# Altium schematic sheet 深圳重合闸控制板.SchDoc
size A1; SheetNumber: 0; SheetTotal: 0; PageSetup: Record=PageOptions|CenterHorizontal=True|CenterVertical=True|PrintScale=0.46|XCorrection=1.00|YCorrection=1.00|PrintKind=0|BorderSize=5000000|LeftOffset=0|BottomOffset=0|Orientation=2|PaperLength=1000|PaperWidth=1000|Scale=100|PaperSource=7|PrintQuality=-3|MediaType=1|DitherType=10|PrintScaleMode=1|PaperKind=A4|PaperIndex=9
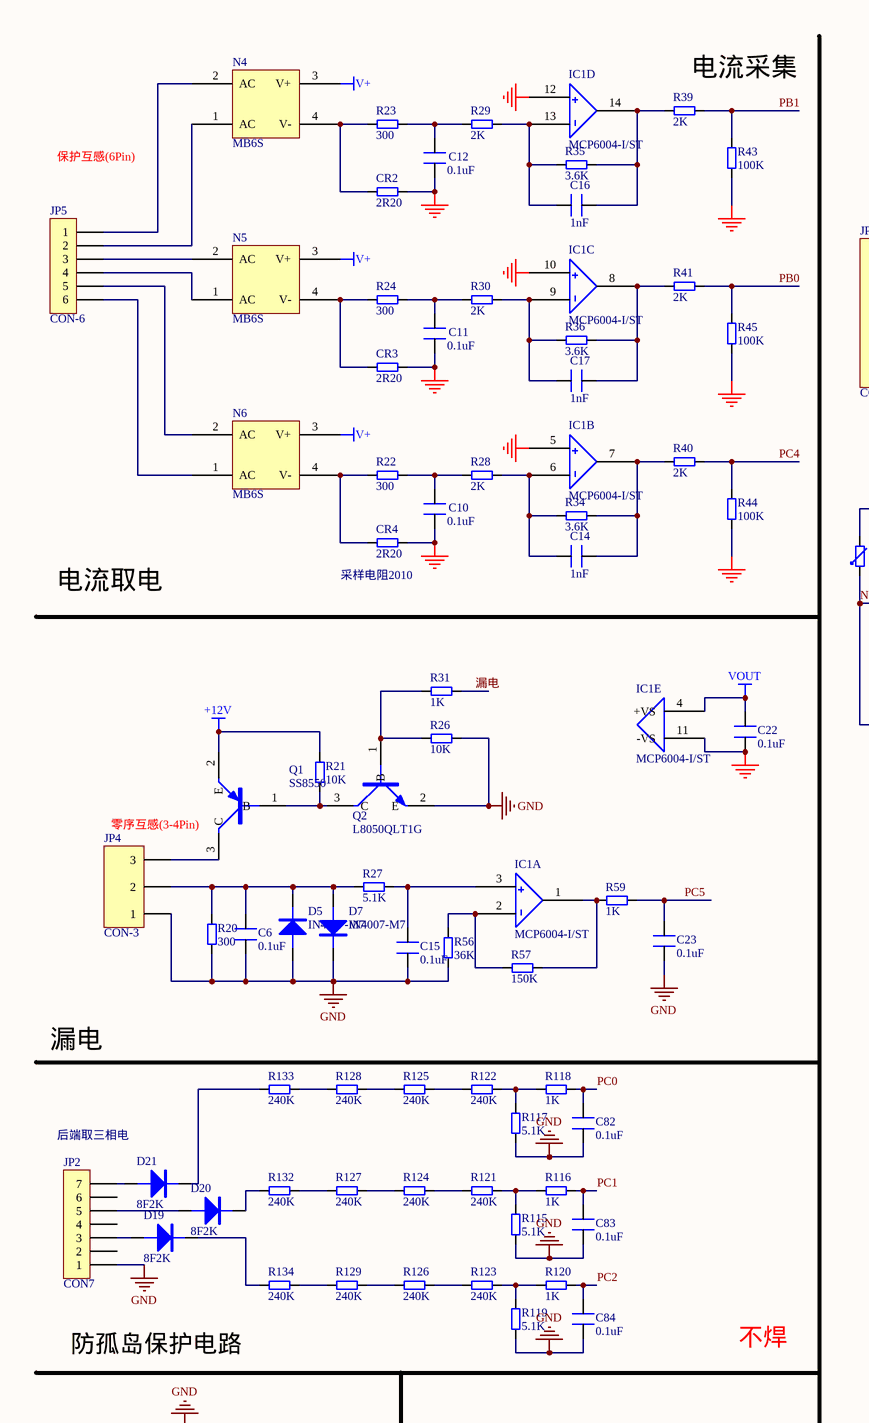
[diagram p0: 深圳重合闸控制板.SchDoc, top left]
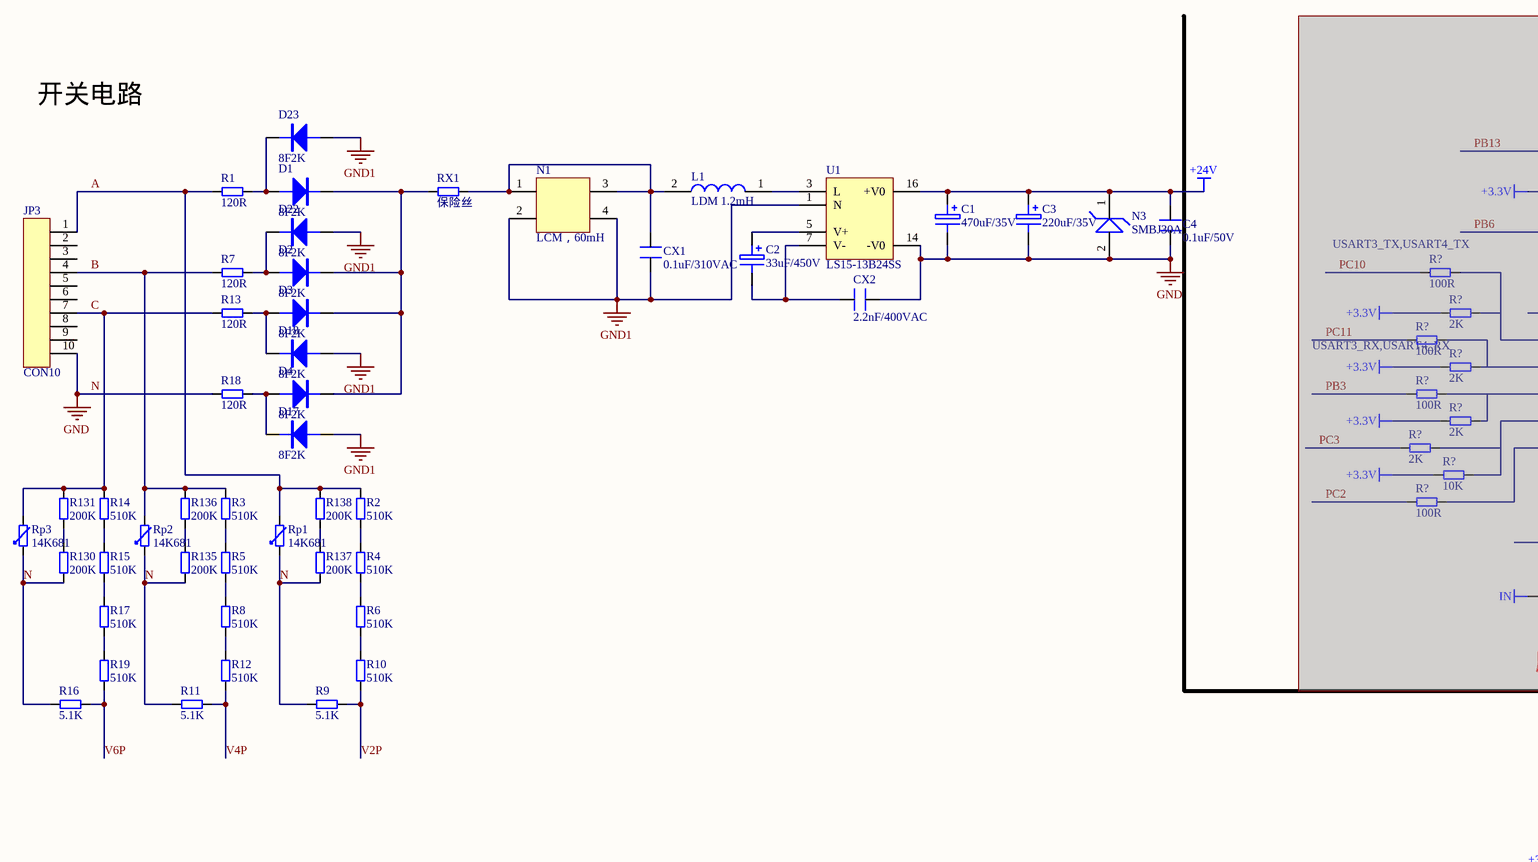
[diagram p1: 深圳重合闸控制板.SchDoc, top middle]
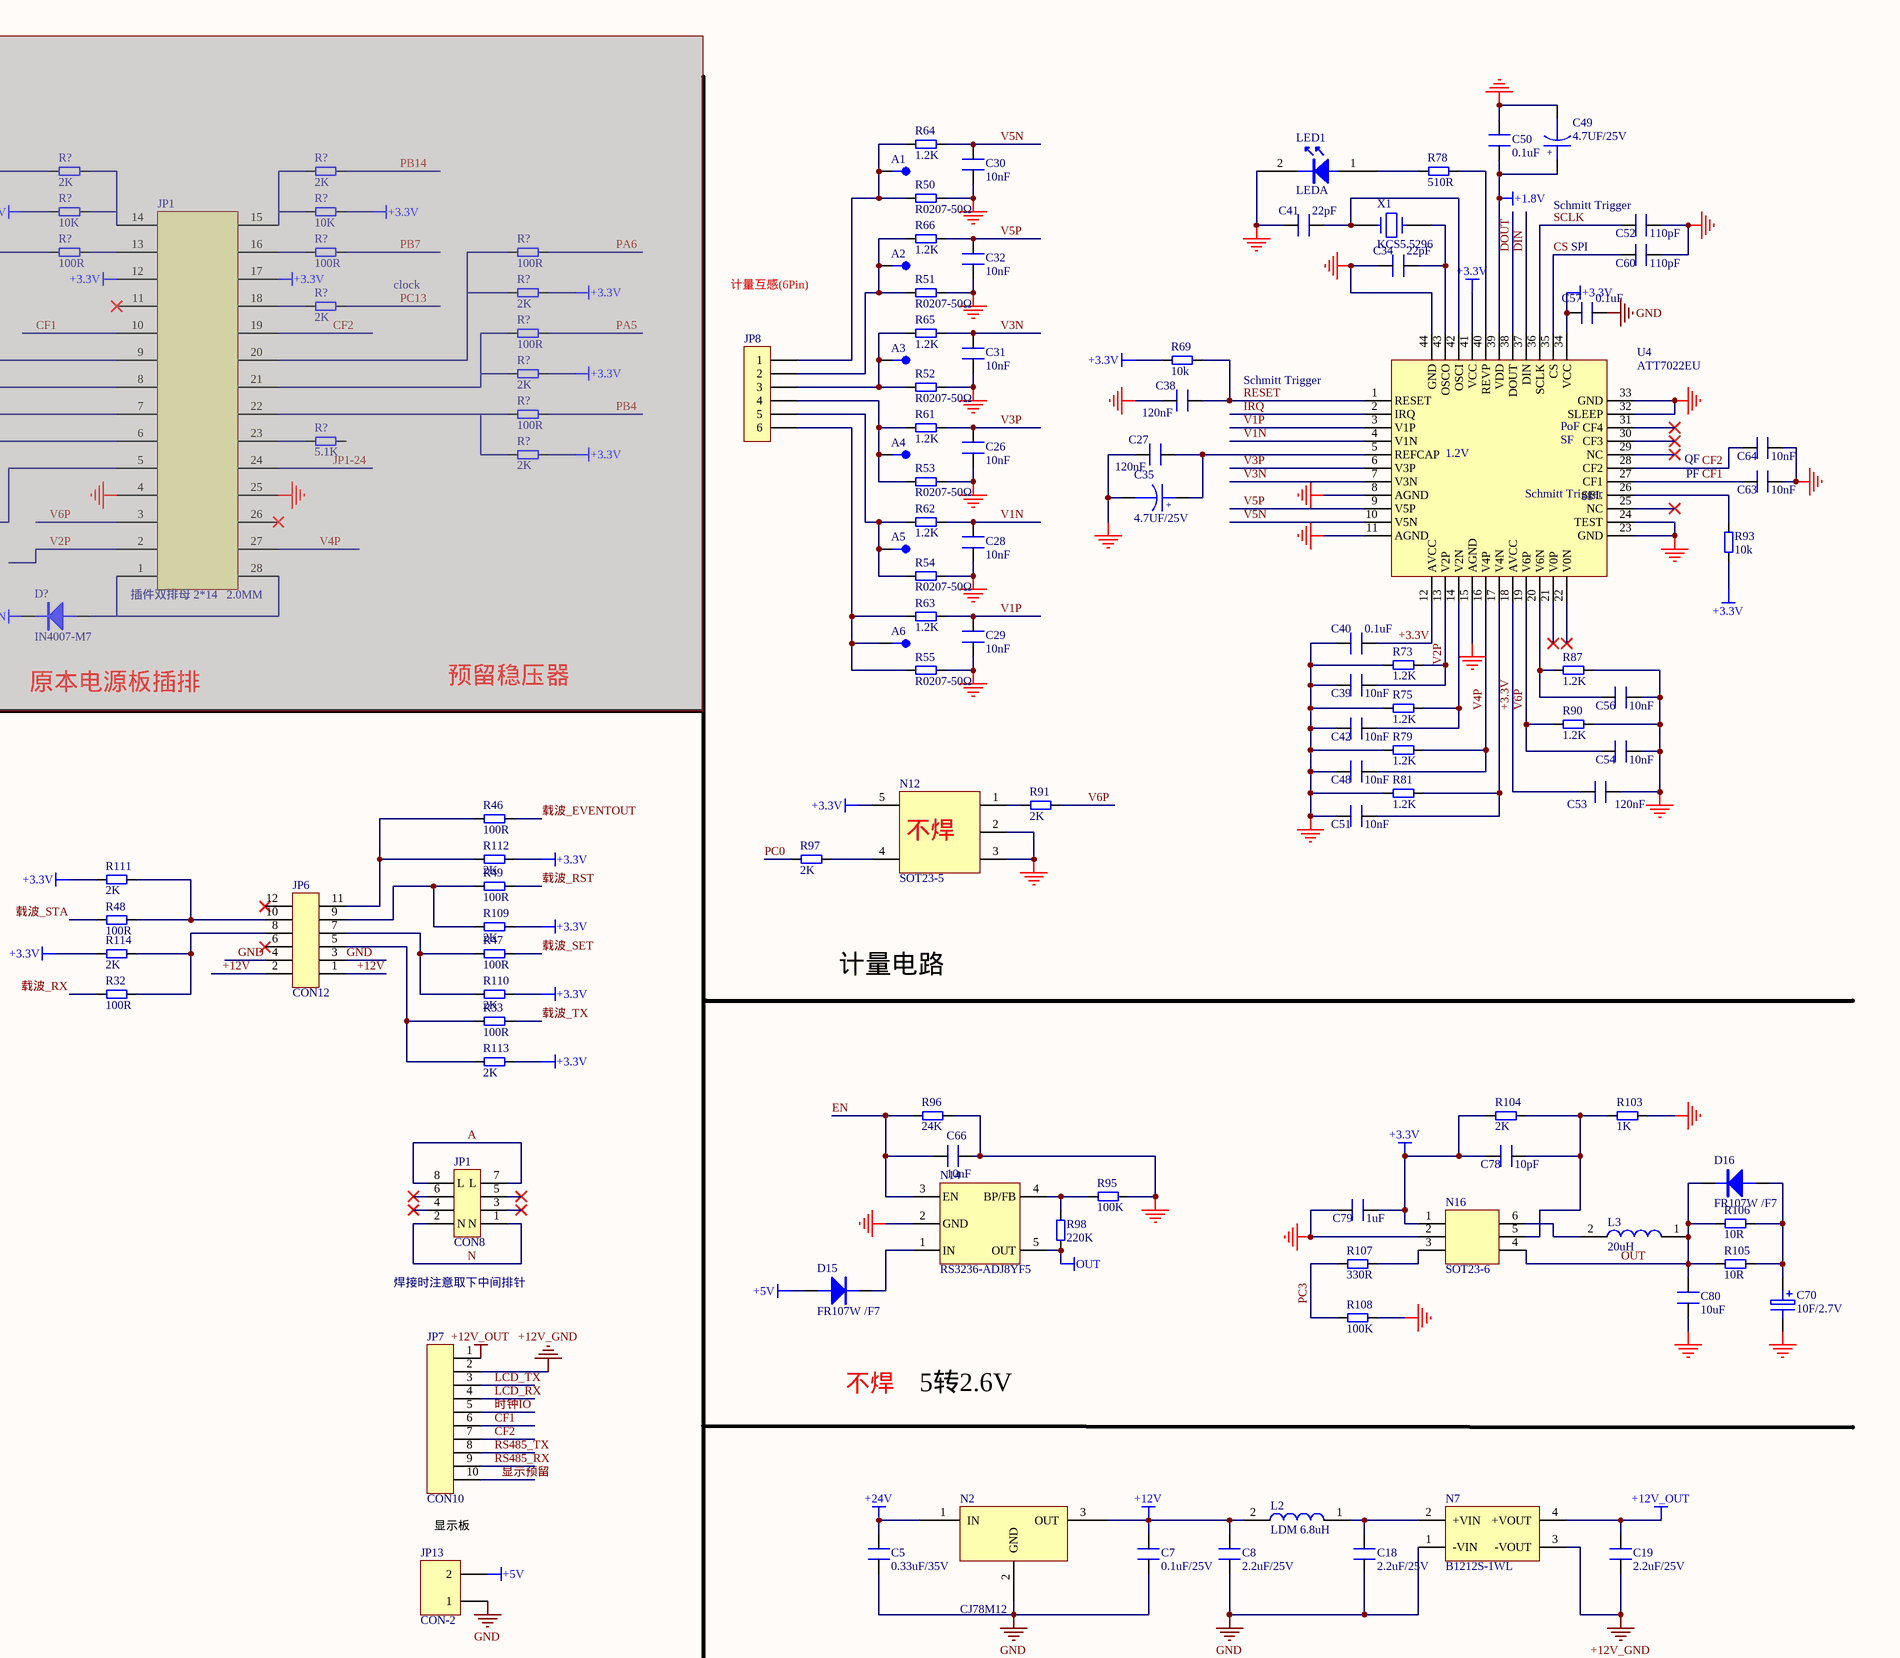
[diagram p2: 深圳重合闸控制板.SchDoc, top right]
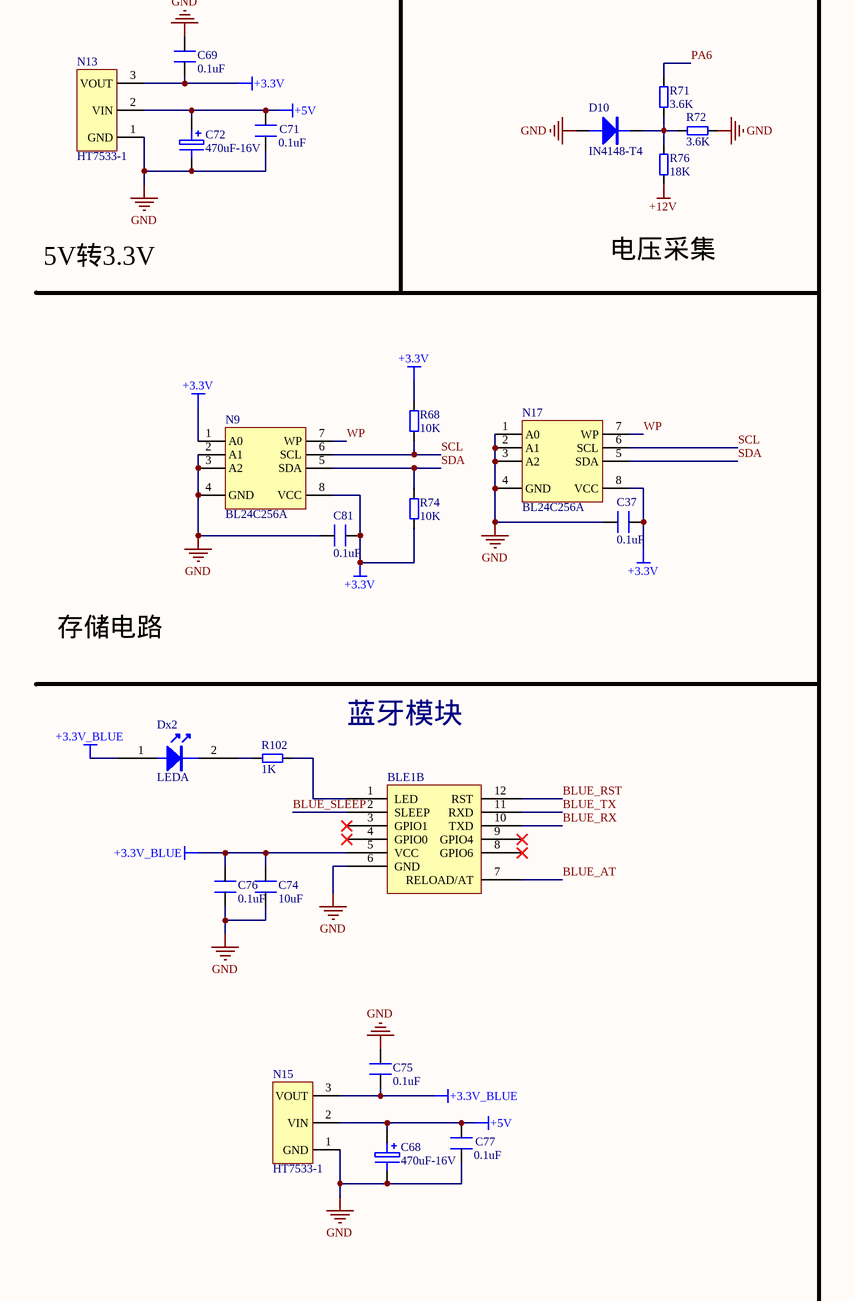
[diagram p3: 深圳重合闸控制板.SchDoc, bottom left]
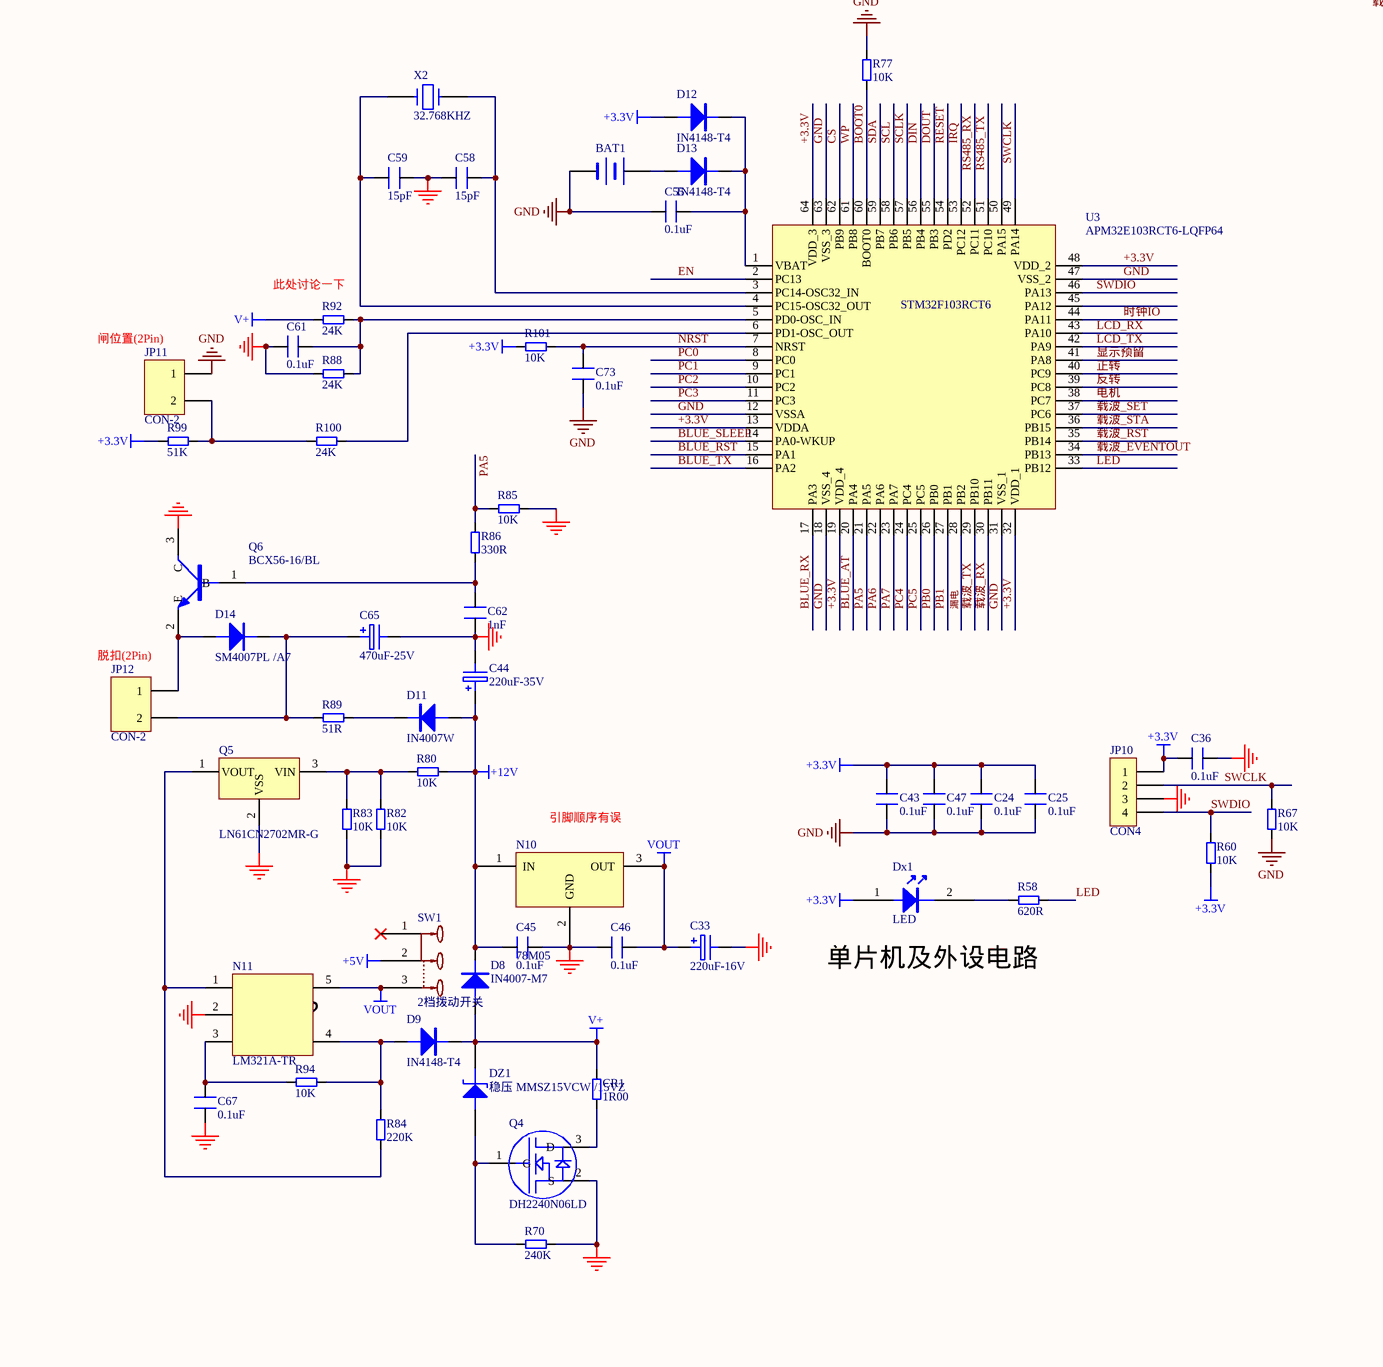
[diagram p4: 深圳重合闸控制板.SchDoc, bottom middle]
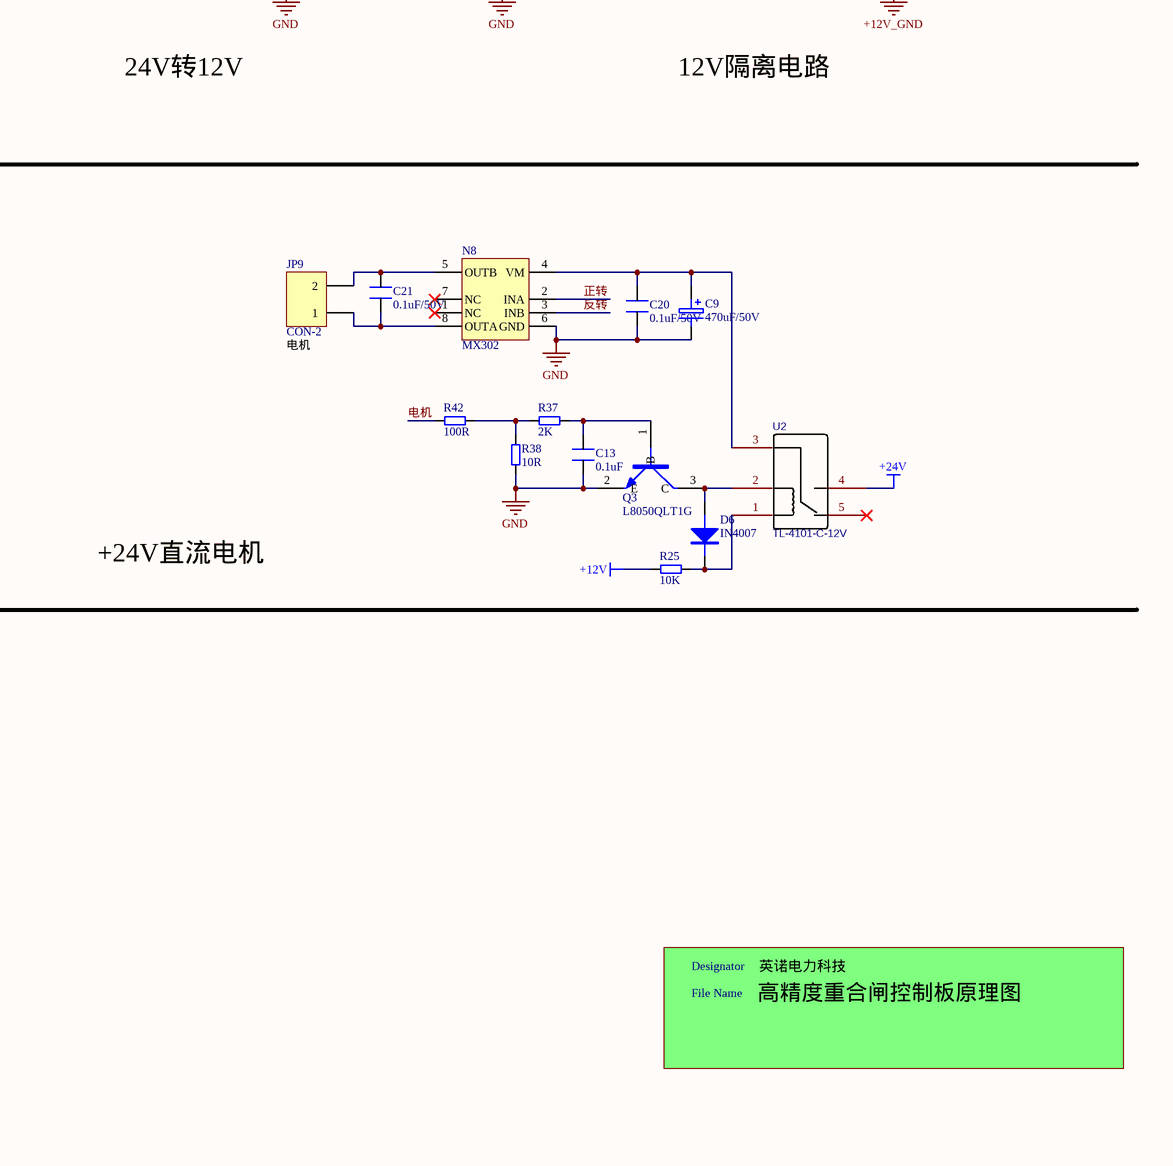
[diagram p5: 深圳重合闸控制板.SchDoc, bottom right]

## Parts
(Parts that share a designator on the sheet are numbered #1, #2 ... from top to bottom, then left to right.)
A1  TP  [TP]  (value not drawn)
A2  TP  [TP]  (value not drawn)
A3  TP  [TP]  (value not drawn)
A4  TP  [TP]  (value not drawn)
A5  TP  [TP]  (value not drawn)
A6  TP  [TP]  (value not drawn)
BAT1  (no value)  [BATTERY]
BLE1  BLE-TPT-BLUETEETH  [蓝牙]  (value not drawn)  (part B of 2)
C1  470uF/35V  [CAP_5.0SP]
C2  33uF/450V  [EWH2WM330K20OT]
C3  220uF/35V  [CAP]
C4  0.1uF/50V  [C0603]
C5  0.33uF/35V  [C0603]
C6  0.1uF  [C0603]
C7  0.1uF/25V  [C0603]
C8  2.2uF/25V  [C0603]
C9  470uF/50V  [RVT1H471M1213]
C10  0.1uF  [C0603]
C11  0.1uF  [C0603]
C12  0.1uF  [C0603]
C13  0.1uF  [C0603]
C14  1nF  [C0603]
C15  0.1uF  [C0603]
C16  1nF  [C0603]
C17  1nF  [C0603]
C18  2.2uF/25V  [C0603]
C19  2.2uF/25V  [C0603]
C20  0.1uF/50V  [C0603]
C21  0.1uF/50V  [C0603]
C22  0.1uF  [C0603]
C23  0.1uF  [C0603]
C24  0.1uF  [C0603]
C25  0.1uF  [C0603]
C26  10nF  [C0603]
C27  120nF  [C0603]
C28  10nF  [C0603]
C29  10nF  [C0603]
C30  10nF  [C0603]
C31  10nF  [C0603]
C32  10nF  [C0603]
C33  220uF-16V  [CAP]
C34  22pF  [C0603]
C35  4.7UF/25V  [CAK]
C36  0.1uF  [C0603]
C37  0.1uF  [c0603]
C38  120nF  [C0603]
C39  10nF  [C0603]
C40  0.1uF  [C0603]
C41  22pF  [C0603]
C42  10nF  [C0603]
C43  0.1uF  [C0603]
C44  220uF-35V  [CAP]
C45  0.1uF  [C0603]
C46  0.1uF  [C0603]
C47  0.1uF  [C0603]
C48  10nF  [C0603]
C49  4.7UF/25V  [CAK]
C50  0.1uF  [C0603]
C51  10nF  [C0603]
C52  110pF  [C0603]
C53  120nF  [C0603]
C54  10nF  [C0603]
C55  0.1uF  [C0603]
C56  10nF  [C0603]
C57  0.1uF  [C0603]
C58  15pF  [C0603]
C59  15pF  [C0603]
C60  110pF  [C0603]
C61  0.1uF  [C0603]
C62  1nF  [C0603]
C63  10nF  [C0603]
C64  10nF  [C0603]
C65  470uF-25V  [CAP]
C66  10nF  [C0603]
C67  0.1uF  [C0603]
C68  470uF-16V  [CAP]
C69  0.1uF  [C0603]
C70  10F/2.7V  [EWH2WM330K20OT]
C71  0.1uF  [C0603]
C72  470uF-16V  [CAP]
C73  0.1uF  [C0603]
C74  10uF  [C0603]
C75  0.1uF  [C0603]
C76  0.1uF  [C0603]
C77  0.1uF  [C0603]
C78  10pF  [C0603]
C79  1uF  [C0603]
C80  10uF  [C0603]
C81  0.1uF  [c0603]
C82  0.1uF  [C0603]
C83  0.1uF  [C0603]
C84  0.1uF  [C0603]
CR1  1R00  [R2010]
CR2  2R20  [R2010]
CR3  2R20  [R2010]
CR4  2R20  [R2010]
CX1  0.1uF/310VAC  [X2-0310A104K10WLBY]
CX2  2.2nF/400VAC  [CT81-400VAC-222M]
D1  8F2K  [IN4007-M7]
D2  8F2K  [IN4007-M7]
D3  8F2K  [IN4007-M7]
D4  8F2K  [IN4007-M7]
D5  IN4007-M7  [IN4007-M7]
D6  IN4007  [IN4007-M7]
D7  IN4007-M7  [IN4007-M7]
D8  IN4007-M7  [IN4007-M7]
D9  IN4148-T4  [IN4148-T4]
D10  IN4148-T4  [IN4148-T4]
D11  IN4007W  [IN4148-T4]
D12  IN4148-T4  [IN4148-T4]
D13  IN4148-T4  [IN4148-T4]
D14  SM4007PL /A7  [IN4148-T4]
D15  FR107W /F7  [IN4148-T4]
D16  FR107W /F7  [IN4148-T4]
D17  8F2K  [IN4007-M7]
D18  8F2K  [IN4007-M7]
D19  8F2K  [IN4007-M7]
D20  8F2K  [IN4007-M7]
D21  8F2K  [IN4007-M7]
D22  8F2K  [IN4007-M7]
D23  8F2K  [IN4007-M7]
D?  IN4007-M7  [IN4007-M7]  (masked out: inside a compile mask, not in the netlist)
Dx1  LED  [LEDB]
Dx2  LEDA  [LEDB]
DZ1  稳压 MMSZ15VCW /15VZ  [IN4148-T4]
IC1  MCP6004-I/ST  [SOP14_0.65SP]  (parts A,B,C,D,E of 5)
JP1#1  插件双排母 2*14   2.0MM  (masked out: inside a compile mask, not in the netlist)
JP1#2  CON8  [SIP2*4_2.54SP]
JP2  CON7  [HDR2.54-7P]
JP3  CON10  [HDR2.54-10P]
JP4  CON-3  [HDR2.54-3P]
JP5  CON-6  [HDR2.54-6P]
JP6  CON12  [SIP2*6_2.54SP]
JP7  CON10  [PH2.0-10P]
JP8  (no value)  [SIP1*6_1.5SP]
JP9  CON-2  [HDR2.54-2P]
JP10  CON4  [HDR2.54-4P]
JP11  CON-2  [HDR2.54-2P]
JP12  CON-2  [HDR2.54-2P]
JP13  CON-2  [PH2.0-2P]
L1  LDM 1.2mH  [PDMTAT044125-6R8MLU]
L2  LDM 6.8uH  [PDMTAT044125-6R8MLU]
L3  20uH  [L0805]
LED1  LEDA  [LEDA]
N1  LCM，60mH  [LCM]
N2  CJ78M12  [TO-252(DPAK)]
N3  SMBJ30A  [SMBJ30A]
N4  MB6S  [MB6S]
N5  MB6S  [MB6S]
N6  MB6S  [MB6S]
N7  B1212S-1WL  [B1212S-1WL]
N8  MX302  [SOP8_1.27SP_4*5SR]
N9  BL24C256A  [SOP8_1.27SP_4*5SR]
N10  78M05  [78M05]
N11  LM321A-TR  [SOT23-5]
N12  SOT23-5  [SOT23-5]
N13  HT7533-1  [HT7533-1]
N14  RS3236-ADJ8YF5  [SOT23-5]
N15  HT7533-1  [HT7533-1]
N16  SOT23-6  [SOT23-6]
N17  BL24C256A  [SOP8_1.27SP_4*5SR]
Q1  SS8550  [S8050 /J3Y]
Q2  L8050QLT1G  [S8050 /J3Y]
Q3  L8050QLT1G  [S8050 /J3Y]
Q4  DH2240N06LD  [78M05]
Q5  LN61CN2702MR-G  [SOT23-3]
Q6  BCX56-16/BL  [BCX56-16/BL]
R1  120R  [插针电阻]
R2  510K  [R0603]
R3  510K  [R0603]
R4  510K  [R0603]
R5  510K  [R0603]
R6  510K  [R0603]
R7  120R  [插针电阻]
R8  510K  [R0603]
R9  5.1K  [R0603]
R10  510K  [R0603]
R11  5.1K  [R0603]
R12  510K  [R0603]
R13  120R  [插针电阻]
R14  510K  [R0603]
R15  510K  [R0603]
R16  5.1K  [R0603]
R17  510K  [R0603]
R18  120R  [插针电阻]
R19  510K  [R0603]
R20  300  [R0603]
R21  10K  [R0603]
R22  300  [R0603]
R23  300  [R0603]
R24  300  [R0603]
R25  10K  [R0603]
R26  10K  [R0603]
R27  5.1K  [R0603]
R28  2K  [R0603]
R29  2K  [R0603]
R30  2K  [R0603]
R31  1K  [R0603]
R32  100R  [R0603]
R33  100R  [R0603]
R34  3.6K  [R0603]
R35  3.6K  [R0603]
R36  3.6K  [R0603]
R37  2K  [R0603]
R38  10R  [R0603]
R39  2K  [R0603]
R40  2K  [R0603]
R41  2K  [R0603]
R42  100R  [R0603]
R43  100K  [R0603]
R44  100K  [R0603]
R45  100K  [R0603]
R46  100R  [R0603]
R47  100R  [R0603]
R48  100R  [R0603]
R49  100R  [R0603]
R50  R0207-50Ω  [R0207]
R51  R0207-50Ω  [R0207]
R52  R0207-50Ω  [R0207]
R53  R0207-50Ω  [R0207]
R54  R0207-50Ω  [R0207]
R55  R0207-50Ω  [R0207]
R56  36K  [R0603]
R57  150K  [R0603]
R58  620R  [R0603]
R59  1K  [R0603]
R60  10K  [R0603]
R61  1.2K  [R0603]
R62  1.2K  [R0603]
R63  1.2K  [R0603]
R64  1.2K  [R0603]
R65  1.2K  [R0603]
R66  1.2K  [R0603]
R67  10K  [R0603]
R68  10K  [R0603]
R69  10k  [R0603]
R70  240K  [R0603]
R71  3.6K  [R0603]
R72  3.6K  [R0603]
R73  1.2K  [R0603]
R74  10K  [R0603]
R75  1.2K  [R0603]
R76  18K  [R0603]
R77  10K  [R0603]
R78  510R  [R0603]
R79  1.2K  [R0603]
R80  10K  [R0603]
R81  1.2K  [R0603]
R82  10K  [R0603]
R83  10K  [R0603]
R84  220K  [R0603]
R85  10K  [R0603]
R86  330R  [R0603]
R87  1.2K  [R0603]
R88  24K  [R0603]
R89  51R  [R1206]
R90  1.2K  [R0603]
R91  2K  [R0603]
R92  24K  [R0603]
R93  10k  [R0603]
R94  10K  [R0603]
R95  100K  [R0603]
R96  24K  [R0603]
R97  2K  [R0603]
R98  220K  [R0603]
R99  51K  [R0603]
R100  24K  [R0603]
R101  10K  [R0603]
R102  1K  [R0603]
R103  1K  [R0603]
R104  2K  [R0603]
R105  10R  [R1206]
R106  10R  [R1206]
R107  330R  [R0603]
R108  100K  [R0603]
R109  2K  [R0603]
R110  2K  [R0603]
R111  2K  [R0603]
R112  2K  [R0603]
R113  2K  [R0603]
R114  2K  [R0603]
R115  5.1K  [R0603]
R116  1K  [R0603]
R117  5.1K  [R0603]
R118  1K  [R0603]
R119  5.1K  [R0603]
R120  1K  [R0603]
R121  240K  [R0603]
R122  240K  [R0603]
R123  240K  [R0603]
R124  240K  [R0603]
R125  240K  [R0603]
R126  240K  [R0603]
R127  240K  [R0603]
R128  240K  [R0603]
R129  240K  [R0603]
R130  200K  [R0603]
R131  200K  [R0603]
R132  240K  [R0603]
R133  240K  [R0603]
R134  240K  [R0603]
R135  200K  [R0603]
R136  200K  [R0603]
R137  200K  [R0603]
R138  200K  [R0603]
R?#1  2K  [R0603]  (masked out: inside a compile mask, not in the netlist)
R?#2  2K  [R0603]  (masked out: inside a compile mask, not in the netlist)
R?#3  10K  [R0603]  (masked out: inside a compile mask, not in the netlist)
R?#4  10K  [R0603]  (masked out: inside a compile mask, not in the netlist)
R?#5  100R  [R0603]  (masked out: inside a compile mask, not in the netlist)
R?#6  100R  [R0603]  (masked out: inside a compile mask, not in the netlist)
R?#7  100R  [R0603]  (masked out: inside a compile mask, not in the netlist)
R?#8  100R  [R0603]  (masked out: inside a compile mask, not in the netlist)
R?#9  2K  [R0603]  (masked out: inside a compile mask, not in the netlist)
R?#10  2K  [R0603]  (masked out: inside a compile mask, not in the netlist)
R?#11  2K  [R0603]  (masked out: inside a compile mask, not in the netlist)
R?#12  100R  [R0603]  (masked out: inside a compile mask, not in the netlist)
R?#13  100R  [R0603]  (masked out: inside a compile mask, not in the netlist)
R?#14  2K  [R0603]  (masked out: inside a compile mask, not in the netlist)
R?#15  2K  [R0603]  (masked out: inside a compile mask, not in the netlist)
R?#16  100R  [R0603]  (masked out: inside a compile mask, not in the netlist)
R?#17  100R  [R0603]  (masked out: inside a compile mask, not in the netlist)
R?#18  2K  [R0603]  (masked out: inside a compile mask, not in the netlist)
R?#19  5.1K  [R0603]  (masked out: inside a compile mask, not in the netlist)
R?#20  2K  [R0603]  (masked out: inside a compile mask, not in the netlist)
R?#21  2K  [R0603]  (masked out: inside a compile mask, not in the netlist)
R?#22  10K  [R0603]  (masked out: inside a compile mask, not in the netlist)
R?#23  100R  [R0603]  (masked out: inside a compile mask, not in the netlist)
Rp1  14K681  [14K681]
Rp2  14K681  [14K681]
Rp3  14K681  [14K681]
RX1  保险丝  [插针电阻]
SW1  2档拨动开关  [SW-3]
U1  LS15-13B24SS  [LS15-13B24SS-F]
U2  TL-4101-C-12V  [TL4101]
U3  APM32E103RCT6-LQFP64  [LQFP-64]
U4  ATT7022EU  [LQFP44_0.8SP_10*10SR]
X1  KCS5.5296  [CRYSTAL2]
X2  32.768KHZ  [CRYSTAL1]

## Sub-sheets
Designator = File Name: no entries

## Nets
+1.8V: C49.1 C50.2 U4.39(VDD)
+3.3V: C24.1 C25.1 C36.1 C37.1 C40.1 C43.1 C47.1 C53.2 C57.2 C69.2 C78.2 C79.1 C81.1 D12.1(A) Dx1.1 JP10.1 N9.1(A0) N9.8(VCC) N12.5 N13.3(VOUT) N16.1 N17.8(VCC) R60.1 R68.2 R69.2 R74.1 R93.2 R99.1 R101.2 R104.1 R109.2 R110.2 R111.2 R112.2 R113.2 R114.2 U3.13(VDDA) U3.19(VDD_4) U3.32(VDD_1) U3.48(VDD_2) U3.64(VDD_3) U4.12(AVCC) U4.18(AVCC) U4.34(VCC) U4.41(VCC)
+3.3V_BLUE: BLE1.5(VCC) C74.2 C75.2 C76.2 Dx2.1 N15.3(VOUT)
+5V: C68.1 C71.2 C72.1 C77.2 D15.1(A) JP13.2 N13.2(VIN) N15.2(VIN) SW1.2
+12V: C7.2 C8.2 C44.1 C45.2 D8.2(K) D11.1(A) JP6.1 JP6.2 L2.2 N2.3(OUT) N10.1(IN) Q1.2(E) R21.2 R25.1 R76.2 R80.1
+12V_GND: C19.1 JP7.2 N7.3(-VOUT)
+12V_OUT: C19.2 JP7.1 N7.4(+VOUT)
+24V: C1.1 C3.1 C4.2 C5.2 N2.1(IN) N3.1 U1.16(+V0) U2.4
GND: BAT1.2(-) BLE1.6(GND) C1.2 C3.2 C4.1 C5.1 C6.1 C7.1 C8.1 C9.2 C10.1 C11.1 C12.1 C13.1 C15.1 C18.1 C20.1 C22.1 C23.2 C24.2 C25.2 C26.1 C27.2 C28.1 C29.1 C30.1 C31.1 C32.1 C33.2 C34.2 C35.2 C36.2 C37.2 C38.2 C39.2 C40.2 C41.2 C42.2 C43.2 C44.2 C45.1 C46.2 C47.2 C48.2 C49.2 C50.1 C51.2 C52.1 C53.1 C54.1 C55.2 C56.1 C57.1 C58.2 C59.1 C60.1 C61.2 C62.2 C63.1 C64.1 C65.2 C66.2 C67.2 C68.2 C69.1 C70.2 C71.1 C72.2 C73.2 C74.1 C75.1 C76.1 C77.1 C79.2 C80.2 C81.2 C82.2 C83.2 C84.2 CR2.1 CR3.1 CR4.1 CX2.1 D5.1(A) D7.2(K) D10.1(A) IC1.5 IC1.10 IC1.11(-VS) IC1.12 JP1#2.1(N) JP1#2.2(N) JP2.1 JP3.10 JP4.1 JP6.3 JP6.4 JP10.3 JP11.1 JP13.1 LED1.2 N2.2(GND) N3.2 N7.1(-VIN) N8.6(GND) N9.2(A1) N9.3(A2) N9.4(GND) N10.2(GND) N11.2 N12.2 N12.3 N13.1(GND) N14.2(GND) N15.1(GND) N16.2 N17.1(A0) N17.2(A1) N17.3(A2) N17.4(GND) Q2.2(E) Q3.2(E) Q4.2(S) Q5.2(VSS) Q6.3(C) R9.1 R11.1 R16.1 R18.2 R20.1 R26.1 R38.2 R43.2 R44.2 R45.2 R50.2 R51.2 R52.2 R53.2 R54.2 R55.2 R56.2 R67.1 R70.2 R72.1 R73.2 R75.2 R77.1 R79.2 R81.2 R82.1 R83.1 R85.2 R87.1 R88.1 R90.1 R95.2 R96.2 R103.2 R108.2 R115.2 R117.2 R119.2 R130.2 R135.2 R137.2 Rp1.2 Rp2.2 Rp3.2 U1.14(-V0) U3.12(VSSA) U3.18(VSS_4) U3.31(VSS_1) U3.47(VSS_2) U3.63(VSS_3) U4.8(AGND) U4.11(AGND) U4.15(AGND) U4.23(GND) U4.24(TEST) U4.32(SLEEP) U4.33(GND) U4.44(GND)  [also labelled N]
GND1: CX1.1 D17.1(A) D18.1(A) D22.1(A) D23.1(A) N1.2 N1.4 U1.1(N)
OUT: C80.1 D16.2(K) L3.1 N14.5(OUT) N16.4 R98.1 R105.1 R106.1
V+: CR1.2 D8.1(A) D9.2(K) DZ1.2(K) N4.3(V+) N5.3(V+) N6.3(V+) R92.1
VOUT: C22.2 C33.1 C46.1 IC1.4(+VS) N10.3(OUT) N11.5 SW1.3
A: JP1#2.7(L) JP1#2.8(L) JP3.1 R1.2 R2.1 R138.1 Rp1.1
B: JP3.4 R3.1 R7.2 R136.1 Rp2.1
BLUE_AT: BLE1.7(RELOAD/AT) U3.20(PA4)
BLUE_RST: BLE1.12(RST) U3.15(PA1)
BLUE_RX: BLE1.10(TXD) U3.17(PA3)
BLUE_SLEEP: BLE1.2(SLEEP) U3.14(PA0-WKUP)
BLUE_TX: BLE1.11(RXD) U3.16(PA2)
BOOT0: R77.2 U3.60(BOOT0)
C: JP3.7 R13.2 R14.1 R131.1 Rp3.1
CF1: C63.2 JP7.6 U4.27(CF1)
CF2: C64.2 JP7.7 U4.28(CF2)
CS: C60.2 U3.62(PB9) U4.35(CS)
DIN: U3.56(PB4) U4.37(DIN)
DOUT: U3.55(PB3) U4.38(DOUT)
EN: C66.1 N14.3(EN) R96.1 U3.2(PC13)
IRQ: U3.53(PC12) U4.2(IRQ)
LCD_RX: JP7.4 U3.43(PA10)
LCD_TX: JP7.3 U3.42(PA9)
LED: R58.1 U3.33(PB12)
NRST: C73.1 R101.1 U3.7(NRST)
PA5: R85.1 R86.2 U3.21(PA5)
PA6: R71.1 U3.22(PA6)
PA7: U3.23(PA7)
PB0: R41.1 R45.1 U3.26(PB0)
PB1: R39.1 R43.1 U3.27(PB1)
PC0: C82.1 R97.1 R118.2 U3.8(PC0)
PC1: C83.1 R116.2 U3.9(PC1)
PC2: C84.1 R120.2 U3.10(PC2)
PC3: R107.1 R108.1 U3.11(PC3)
PC4: R40.1 R44.1 U3.24(PC4)
PC5: C23.1 R59.1 U3.25(PC5)
RESET: C38.1 R69.1 U3.54(PD2) U4.1(RESET)
RS485_RX: JP7.9 U3.52(PC11)
RS485_TX: JP7.8 U3.51(PC10)
SCL: N9.6(SCL) N17.6(SCL) R68.1 U3.58(PB6)
SCLK: C52.2 U3.57(PB5) U4.36(SCLK)
SDA: N9.5(SDA) N17.5(SDA) R74.2 U3.59(PB7)
SWCLK: JP10.2 R67.2 U3.49(PA14)
SWDIO: JP10.4 R60.2 U3.46(PA13)
V1N: C28.2 R62.1 U4.4(V1N)
V1P: C29.2 R63.1 U4.3(V1P)
V2P: C39.1 R9.2 R10.2 R73.1 U4.13(V2P)
V3N: C31.2 R65.1 U4.7(V3N)
V3P: C26.2 R61.1 U4.6(V3P)
V4P: C48.1 R11.2 R12.2 R79.1 U4.16(V4P)
V5N: C30.2 R64.1 U4.10(V5N)
V5P: C32.2 R66.1 U4.9(V5P)
V6P: C54.2 R16.2 R19.2 R90.2 R91.2 U4.19(V6P)
WP: N9.7(WP) N17.7(WP) U3.61(PB8)
反转: N8.3(INB) U3.39(PC8)
时钟IO: JP7.5 U3.44(PA11)
显示预留: JP7.10 U3.41(PA8)
正转: N8.2(INA) U3.40(PC9)
漏电: R31.1 U3.28(PB2)
电机: R42.1 U3.38(PC7)
载波_EVENTOUT: R46.2 U3.34(PB13)
载波_RST: R49.2 U3.35(PB14)
载波_RX: R32.2 U3.30(PB11)
载波_SET: R47.2 U3.37(PC6)
载波_STA: R48.2 U3.36(PB15)
载波_TX: R33.2 U3.29(PB10)
NetA1_1: A1.1 JP8.1 R50.1 R64.2
NetA2_1: A2.1 JP8.2 R51.1 R66.2
NetA3_1: A3.1 JP8.3 R52.1 R65.2
NetA4_1: A4.1 JP8.4 R53.1 R61.2
NetA5_1: A5.1 JP8.5 R54.1 R62.2
NetA6_1: A6.1 JP8.6 R55.1 R63.2
NetBAT1_1: BAT1.1(+) D13.1(A)
NetBLE1_1: BLE1.1(LED) R102.2
NetC2_1: C2.1 U1.5(V+)
NetC2_2: C2.2 CX2.2 U1.7(V-)
NetC6_2: C6.2 D5.2(K) D7.1(A) JP4.2 R20.2 R27.2
NetC9_1: C9.1 C20.2 N8.4(VM) U2.3
NetC10_2: C10.2 R22.1 R28.2
NetC11_2: C11.2 R24.1 R30.2
NetC12_2: C12.2 R23.1 R29.2
NetC13_2: C13.2 Q3.1(B) R37.2
NetC14_1: C14.1 IC1.7 R34.1 R40.2
NetC14_2: C14.2 IC1.6 R28.1 R34.2
NetC15_2: C15.2 IC1.3 R27.1
NetC16_1: C16.1 IC1.14 R35.1 R39.2
NetC16_2: C16.2 IC1.13 R29.1 R35.2
NetC17_1: C17.1 IC1.8 R36.1 R41.2
NetC17_2: C17.2 IC1.9 R30.1 R36.2
NetC18_2: C18.2 L2.1 N7.2(+VIN)
NetC21_1: C21.1 JP9.1 N8.8(OUTA)
NetC21_2: C21.2 JP9.2 N8.5(OUTB)
NetC27_1: C27.1 C35.1 U4.5(REFCAP)
NetC34_1: C34.1 U4.43(OSCO) X1.2
NetC41_1: C41.1 U4.42(OSCI) X1.1
NetC42_1: C42.1 R75.1 U4.14(V2N)
NetC51_1: C51.1 R81.1 U4.17(V4N)
NetC55_1: C55.1 D12.2(K) D13.2(K) U3.1(VBAT)
NetC56_2: C56.2 R87.2 U4.20(V6N)
NetC58_1: C58.1 U3.3(PC14-OSC32_IN) X2.2
NetC59_2: C59.2 U3.4(PC15-OSC32_OUT) X2.1
NetC61_1: C61.1 R88.2 R92.2 U3.5(PD0-OSC_IN)
NetC62_1: C62.1 Q6.1(B) R86.1
NetC65_1: C65.1 D14.2(K) JP12.2 R89.1
NetC67_1: C67.1 N11.3 R94.1
NetC70_1: C70.1 D16.1(A) R105.2 R106.2
NetC78_1: C78.1 N16.5 R103.1 R104.2
NetCR1_1: CR1.1 Q4.3(D)
NetCR2_2: CR2.2 N4.4(V-) R23.2
NetCR3_2: CR3.2 N5.4(V-) R24.2
NetCR4_2: CR4.2 N6.4(V-) R22.2
NetCX1_2: CX1.2 L1.2 N1.1 N1.3 RX1.2
NetD1_1: D1.1(A) D23.2(K) R1.1
NetD1_2: D1.2(K) D2.2(K) D3.2(K) D4.2(K) RX1.1
NetD2_1: D2.1(A) D22.2(K) R7.1
NetD3_1: D3.1(A) D18.2(K) R13.1
NetD4_1: D4.1(A) D17.2(K) R18.1
NetD6_1: D6.1(A) Q3.3(C) U2.2
NetD6_2: D6.2(K) R25.2 U2.1
NetD9_1: D9.1(A) N11.4 R84.2 R94.2
NetD10_2: D10.2(K) R71.2 R72.2 R76.1
NetD11_2: D11.2(K) R89.2
NetD14_1: D14.1(A) JP12.1 Q6.2(E)
NetD15_2: D15.2(K) N14.1(IN)
NetD19_1: D19.1(A) JP2.3
NetD19_2: D19.2(K) R134.1
NetD20_1: D20.1(A) JP2.5
NetD20_2: D20.2(K) R132.1
NetD21_1: D21.1(A) JP2.7
NetD21_2: D21.2(K) R133.1
NetDx1_2: Dx1.2 R58.2
NetDx2_2: Dx2.2 R102.1
NetDZ1_1: DZ1.1(A) Q4.1(G) R70.1
NetIC1_1: IC1.1 R57.2 R59.2
NetIC1_2: IC1.2 R56.1 R57.1
NetJP4_3: JP4.3 Q1.3(C)
NetJP5_1: JP5.1 N4.2(AC)
NetJP5_2: JP5.2 N4.1(AC)
NetJP5_3: JP5.3 N5.2(AC)
NetJP5_4: JP5.4 N5.1(AC)
NetJP5_5: JP5.5 N6.2(AC)
NetJP5_6: JP5.6 N6.1(AC)
NetJP6_5: JP6.5 R33.1 R113.1
NetJP6_7: JP6.7 R47.1 R110.1
NetJP6_8: JP6.8 R32.1 R114.1
NetJP6_9: JP6.9 R49.1 R109.1
NetJP6_10: JP6.10 R48.1 R111.1
NetJP6_11: JP6.11 R46.1 R112.1
NetJP11_2: JP11.2 R99.2 R100.1
NetL1_1: L1.1 U1.3(L)
NetL3_2: L3.2 N16.6
NetLED1_1: LED1.1 R78.2
NetN11_1: N11.1 Q5.1(VOUT) R84.1
NetN12_1: N12.1 R91.1
NetN12_4: N12.4 R97.2
NetN14_4: N14.4(BP/FB) R95.1 R98.2
NetN16_3: N16.3 R107.2
NetQ1_1: Q1.1(B) Q2.3(C) R21.1
NetQ2_1: Q2.1(B) R26.2 R31.2
NetQ5_3: Q5.3(VIN) R80.2 R82.2 R83.2
NetR2_2: R2.2 R4.1
NetR3_2: R3.2 R5.1
NetR4_2: R4.2 R6.1
NetR5_2: R5.2 R8.1
NetR6_2: R6.2 R10.1
NetR8_2: R8.2 R12.1
NetR14_2: R14.2 R15.1
NetR15_2: R15.2 R17.1
NetR17_2: R17.2 R19.1
NetR37_1: R37.1 R38.1 R42.2
NetR78_1: R78.1 U4.40(REVP)
NetR93_1: R93.1 U4.26(SEL)
NetR100_2: R100.2 U3.6(PD1-OSC_OUT)
NetR115_1: R115.1 R116.1 R121.2
NetR117_1: R117.1 R118.1 R122.2
NetR119_1: R119.1 R120.1 R123.2
NetR121_1: R121.1 R124.2
NetR122_1: R122.1 R125.2
NetR123_1: R123.1 R126.2
NetR124_1: R124.1 R127.2
NetR125_1: R125.1 R128.2
NetR126_1: R126.1 R129.2
NetR127_1: R127.1 R132.2
NetR128_1: R128.1 R133.2
NetR129_1: R129.1 R134.2
NetR130_1: R130.1 R131.2
NetR135_1: R135.1 R136.2
NetR137_1: R137.1 R138.2

Not connected (* = marked no-connect by the designer): BLE1 3(GPIO1)* 4(GPIO0)* 8(GPIO6)* 9(GPIO4)*; JP1#2 3* 4* 5* 6*; JP2 2 4 6; JP3 2 3 5 6 8 9; JP6 6* 12*; N8 1(NC)* 7(NC)*; SW1 1*; U2 5*; U3 45(PA12) 50(PA15); U4 21(V0P)* 22(V0N)* 25(NC)* 29(NC)* 30(CF3)* 31(CF4)*

## Notes on the sheet
- (near R39) 电流采集
- 开关电路
- 保护互感(6Pin)
- (near C52) Schmitt Trigger
- (near R?#8) USART3_TX,USART4_TX
- SPI
- clock
- 计量互感(6Pin)
- (near R?#13) USART3_RX,USART4_RX
- Schmitt Trigger
- (near U4) 1.2V
- (near U4) PoF
- (near U4) SF
- QF
- PF
- (near U4) Schmitt Trigger
- 电流取电
- (near CR4) 采样电阻2010
- 预留稳压器
- 原本电源板插排
- 零序互感(3-4Pin)
- (near N12) 不焊
- 计量电路
- 漏电
- 后端取三相电
- (near R92) 此处讨论一下
- 焊接时注意取下中间排针
- 防孤岛保护电路
- 不焊
- (near JP11) 闸位置(2Pin)
- (near U3) STM32F103RCT6
- 5转2.6V
- 显示板
- 5V转3.3V
- 电压采集
- (near JP12) 脱扣(2Pin)
- 24V转12V
- 12V隔离电路
- (near N10) 引脚顺序有误
- (near Dx1) 单片机及外设电路
- 存储电路
- (near N11) ？？？
- (near JP9) 电机
- 蓝牙模块
- +24V直流电机
- 高精度重合闸控制板原理图
- 英诺电力科技
- Title
- Size:
- Date:
- File:
- A1
- Number:
- Time:
- Revision:
- Sheet
- of
- (in symbol CAK) +

## Library data of the parts
BAT1 = BATTERY
C1-C3 C9 C33 C44 C65 C68 C70 C72 = ELECTRO1: 电解电容
C4-C8 C10-C32 C34 C36-C43 C45-C48 C50-C64 C66 C67 C69 C71 C73-C84 = C: 电容
C35 C49 = CAK
CR1-CR4 = R: 采样电阻
CX1 = C: X2-0310A104K10WLBY
CX2 = C: CT81-400VAC-222M
D1-D23 D? = DIODE: 二极管
Dx1 Dx2 = LEDA: 发光二极管
DZ1 = ZENER2: Zener Diode
IC1 = 14A_1_1_1_1
JP1#1 = SOP-28-JP1
JP1#2 = CON8: 2*4pin连接器
JP2 = CON7: 直插 1*7P
JP3 JP7 = CON10: 1*10pin连接器
JP4 = CON-3: 直插  1*3P
JP5 = CON-6: 直插 XH2.54 1*6P
JP6 = CON12: 2*6pin连接器
JP8 = CON-6: 直插 1*6P
JP9 JP11-JP13 = CON-2: 直插 1*2Pin
JP10 = CON4: 连接件 1*4Pin
L1 L2 = L: 电感(0.4A-4Ω)
L3 = L: 电感
LED1 = LEDA: LED,白发红
N1 = LCM: 共模电感
N2 = CJ78M12: 线性LDO,500mA
N3 = TVS
N4-N6 = MB6S: 整流器
N7 = B1212S-1WL: 12转12隔离电源
N8 = MX302: 电机驱动芯片
N9 N17 = BL24C256A: EEPROM
N10 = 78M05: 78M05 5V,500mA
N11 = SOT23-5
N13 N15 = HT7533-1: LDO,100mA
N14 = RS3236-ADJ8YF5: 稳压器
Q1 = PNP: PNP三极管
Q2 Q3 Q6 = BCX56-16/BL: NPN三极管
Q4 = 2N7002: 贴片场效应管,江苏长电; Text Field1: 贴片N沟道场效应管; Text Field2: 2N7002,江苏长电; Text Field3: SOT-23
R1-R138 R?#1-R?#23 RX1 = R: 电阻
Rp1-Rp3 = 14D: 压敏电阻
SW1 = SW-3: BOM_Supplier: *; BOM_Supplier Part: *; BOM_Manufacturer: *; BOM_Manufacturer Part: *; Contributor: *; spicePre: *; spiceSymbolName: *
U1 = LS15-13B24SS: 开关电源模块
U2 = TL-4101-C-12V: 继电器; BOM_Manufacturer: HUIKE; BOM_Manufacturer Part: HK4100F-DC5V-SHG; Contributor: hxf7582; BOM_Supplier: LCSC; image: //image.lceda.cn/szlcsc/C12072.jpg; BOM_Supplier Part: C12072; spicePre: K; spiceSymbolName: TL4101
U3 = APM32E103RCT6-LQFP64: 单片机
X1 X2 = CRYSTAL: 晶振
Q5 = LN61CN2702MR-G: BOM_Supplier: *; BOM_Supplier Part: *; BOM_Manufacturer: *; BOM_Manufacturer Part: *; Contributor: *; BOM_JLCPCB Part Class: *; spicePre: *; spiceSymbolName: *; Package Display: *